# EAGLE design LF (EAGLE 7.6.0)
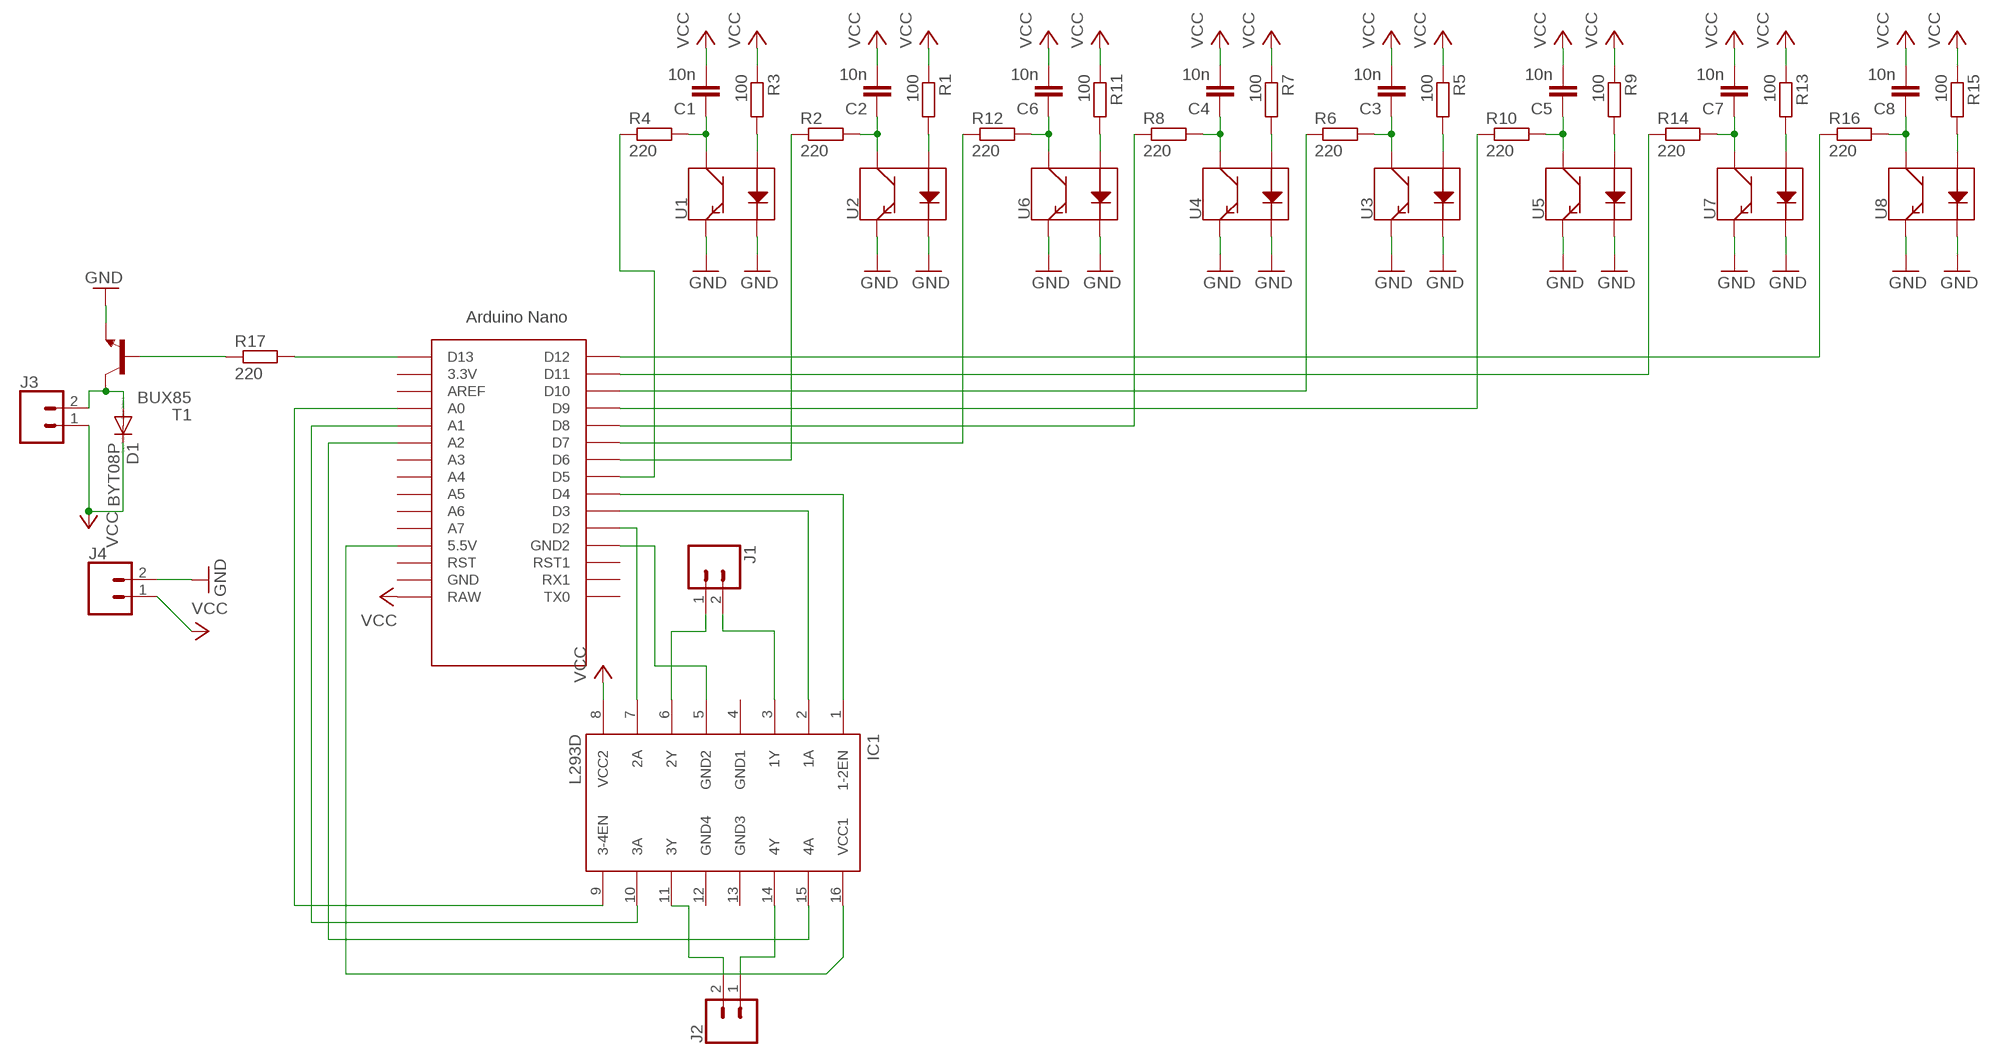
[diagram p0: schematic, sheet 1]

## Parts
C1  10n  C-EUC0402  [C0402]
C2  10n  C-EUC0402  [C0402]
C3  10n  C-EUC0402  [C0402]
C4  10n  C-EUC0402  [C0402]
C5  10n  C-EUC0402  [C0402]
C6  10n  C-EUC0402  [C0402]
C7  10n  C-EUC0402  [C0402]
C8  10n  C-EUC0402  [C0402]
D1  BYT08P  [TO220ACS]
IC1  L293D  [DIL16]
J1  CONN_02  [1X02]
J2  CONN_02  [1X02]
J3  CONN_02  [1X02]
J4  CONN_02  [1X02]
R1  100  R-EU_R0402  [R0402]
R2  220  R-EU_R0402  [R0402]
R3  100  R-EU_R0402  [R0402]
R4  220  R-EU_R0402  [R0402]
R5  100  R-EU_R0402  [R0402]
R6  220  R-EU_R0402  [R0402]
R7  100  R-EU_R0402  [R0402]
R8  220  R-EU_R0402  [R0402]
R9  100  R-EU_R0402  [R0402]
R10  220  R-EU_R0402  [R0402]
R11  100  R-EU_R0402  [R0402]
R12  220  R-EU_R0402  [R0402]
R13  100  R-EU_R0402  [R0402]
R14  220  R-EU_R0402  [R0402]
R15  100  R-EU_R0402  [R0402]
R16  220  R-EU_R0402  [R0402]
R17  220  R-EU_R1206  [R1206]
T1  BUX85  [TO220]
U1  QRE1113SMD-W  [QRE1113-W]
U2  QRE1113SMD-W  [QRE1113-W]
U3  QRE1113SMD-W  [QRE1113-W]
U4  QRE1113SMD-W  [QRE1113-W]
U5  QRE1113SMD-W  [QRE1113-W]
U6  QRE1113SMD-W  [QRE1113-W]
U7  QRE1113SMD-W  [QRE1113-W]
U8  QRE1113SMD-W  [QRE1113-W]
U$1  NANO  [NANO]

## Nets
GND: J4.2 T1.3(E) U1.2(K) U1.4(E) U2.2(K) U2.4(E) U3.2(K) U3.4(E) U4.2(K) U4.4(E) U5.2(K) U5.4(E) U6.2(K) U6.4(E) U7.2(K) U7.4(E) U8.2(K) U8.4(E)
N$1: R3.2 U1.1(A)
N$2: C1.1 R4.2 U1.3(C)
N$3: R16.1 U$1.D12
N$4: R1.2 U2.1(A)
N$5: C2.1 R2.2 U2.3(C)
N$6: R5.2 U3.1(A)
N$7: C3.1 R6.2 U3.3(C)
N$8: R7.2 U4.1(A)
N$9: C4.1 R8.2 U4.3(C)
N$10: R9.2 U5.1(A)
N$11: C5.1 R10.2 U5.3(C)
N$12: R11.2 U6.1(A)
N$13: C6.1 R12.2 U6.3(C)
N$14: R13.2 U7.1(A)
N$15: C7.1 R14.2 U7.3(C)
N$16: R15.2 U8.1(A)
N$17: C8.1 R16.2 U8.3(C)
N$18: R14.1 U$1.D11
N$19: R6.1 U$1.D10
N$20: R10.1 U$1.D9
N$21: R8.1 U$1.D8
N$22: R12.1 U$1.D7
N$23: R2.1 U$1.D6
N$24: R4.1 U$1.D5
N$25: IC1.1(1-2EN) U$1.D4
N$26: IC1.2(1A) U$1.D3
N$27: IC1.7(2A) U$1.D2
N$28: IC1.9(3-4EN) U$1.A0
N$29: IC1.10(3A) U$1.A1
N$30: IC1.15(4A) U$1.A2
N$31: IC1.6(2Y) J1.1
N$32: IC1.3(1Y) J1.2
N$33: IC1.5(GND2) U$1.GND1(GND2)
N$34: IC1.11(3Y) J2.2
N$35: IC1.14(4Y) J2.1
N$36: IC1.16(VCC1) U$1.5V(5.5V)
N$37: R17.2 U$1.D13
N$38: R17.1 T1.1(B)
N$39: D1.A J3.2 T1.2(C)
VCC: C1.2 C2.2 C3.2 C4.2 C5.2 C6.2 C7.2 C8.2 D1.C IC1.8(VCC2) J3.1 J4.1 R1.1 R3.1 R5.1 R7.1 R9.1 R11.1 R13.1 R15.1 U$1.RAW
Unconnected: U$1.3.3V U$1.A3 U$1.A4 U$1.A5 U$1.A6 U$1.A7 U$1.AREF U$1.GND U$1.ICSP1 U$1.ICSP2 U$1.ICSP3 U$1.ICSP4 U$1.ICSP5 U$1.ICSP6 U$1.RST U$1.RST1 U$1.RX1 U$1.TX0

## Power pins joined to a net without a drawn wire
GND1: IC1.4(GND1)
GND3: IC1.13(GND3)
GND4: IC1.12(GND4)

## Library data of the parts
C1-C8 = resistor:C-EU: CAPACITOR, European symbol
D1 = diode:BYT08P: DIODE ultra fast
IC1 = st-microelectronics:L293D: PUSH-PULL 4 CHANNEL DRIVER; MPN: L293D; OC_FARNELL: 9589619; OC_NEWARK: 56P8249
J1-J4 = SparkFun-Connectors:CONN_02: Multi connection point. Often used as Generic Header-pin footprint for 0.1 inch spaced/style header connections On any of the 0.1 inch spaced packages, you can populate with these: Break Away Headers - Straight <https://www.sparkfun.com/products/116> (PRT-00116) Break Away Male Headers - Right Angle <https://www.sparkfun.com/products/553> (PRT-00553) Female Headers <https://www.sparkfun.com/products/115> (PRT-00115) Break Away Headers - Machine Pin <https://www.sparkfun.com/products/117> (PRT-00117) Break Away Female Headers - Swiss Machine Pin <https://www.sparkfun.com/products/743> (PRT-00743) For SCREWTERMINALS and SPRING TERMINALS visit here: Screw Terimnals on SparkFun.com <https://www.sparkfun.com/search/results?term=Screw+Terminals> (5mm/3.5mm/2.54mm spacing) This device is also useful as a general connection point to wire up your design to another part of your project. Our various solder wires solder well into these plated through hole pads. Hook-Up Wire - Assortment (Stranded, 22 AWG) <https://www.sparkfun.com/products/11375> (PRT-11375) Hook-Up Wire - Assortment (Solid Core, 22 AWG) <https://www.sparkfun.com/products/11367> (PRT-11367) View the entire wire category on our website here <https://www.sparkfun.com/categories/141> Special notes: Molex polarized connector foot print use with: PRT-08233 with associated crimp pins and housings. 2.54_SCREWTERM for use with PRT-10571. 3.5mm Screw Terminal footprints for PRT-08084 5mm Screw Terminal footprints for use with PRT-08432
R1-R17 = resistor:R-EU_: RESISTOR, European symbol
T1 = transistor:BUX85: NPN TRANSISTOR
U1-U8 = SparkFun-Sensors:QRE1113: QRE1113 Reflective Object Sensor The QRE1113 is a small IR reflectance sensor. This sensor is often used in line following robots because, if it can sense if a surface is white or black. There are four pins on the QRE1113 - two control the IR emitting LED while the other two are the collector and emitter of a phototransistor. The IR diode has a max forward current of 50mA and operates at 940nm. Datasheet <http://www.sparkfun.com/datasheets/Components/SMD/QRE1113.GR.pdf> SparkFun Products IR Reflectance Sensor - QRE1113 <https://www.sparkfun.com/products/9542> (COM-09542) SparkFun Line Sensor Breakout - QRE1113 (Analog) <https://www.sparkfun.com/products/9453> (ROB-09453) SparkFun Line Sensor Breakout - QRE1113 (Digital) <https://www.sparkfun.com/products/9454> (ROB-09454) SparkFun RedBot Sensor - Line Follower <https://www.sparkfun.com/products/11769> (SEN-11769) SparkFun RedBot Sensor - Wheel Encoder <https://www.sparkfun.com/products/12617> (SEN-12617) SparkFun Line Follower Array <https://www.sparkfun.com/products/13582> (SEN-13582); PROD_ID: IC-09357; SF_ID: COM-09542
U$1 = Arduino-clone:NANO: Arduino Nano

## Board
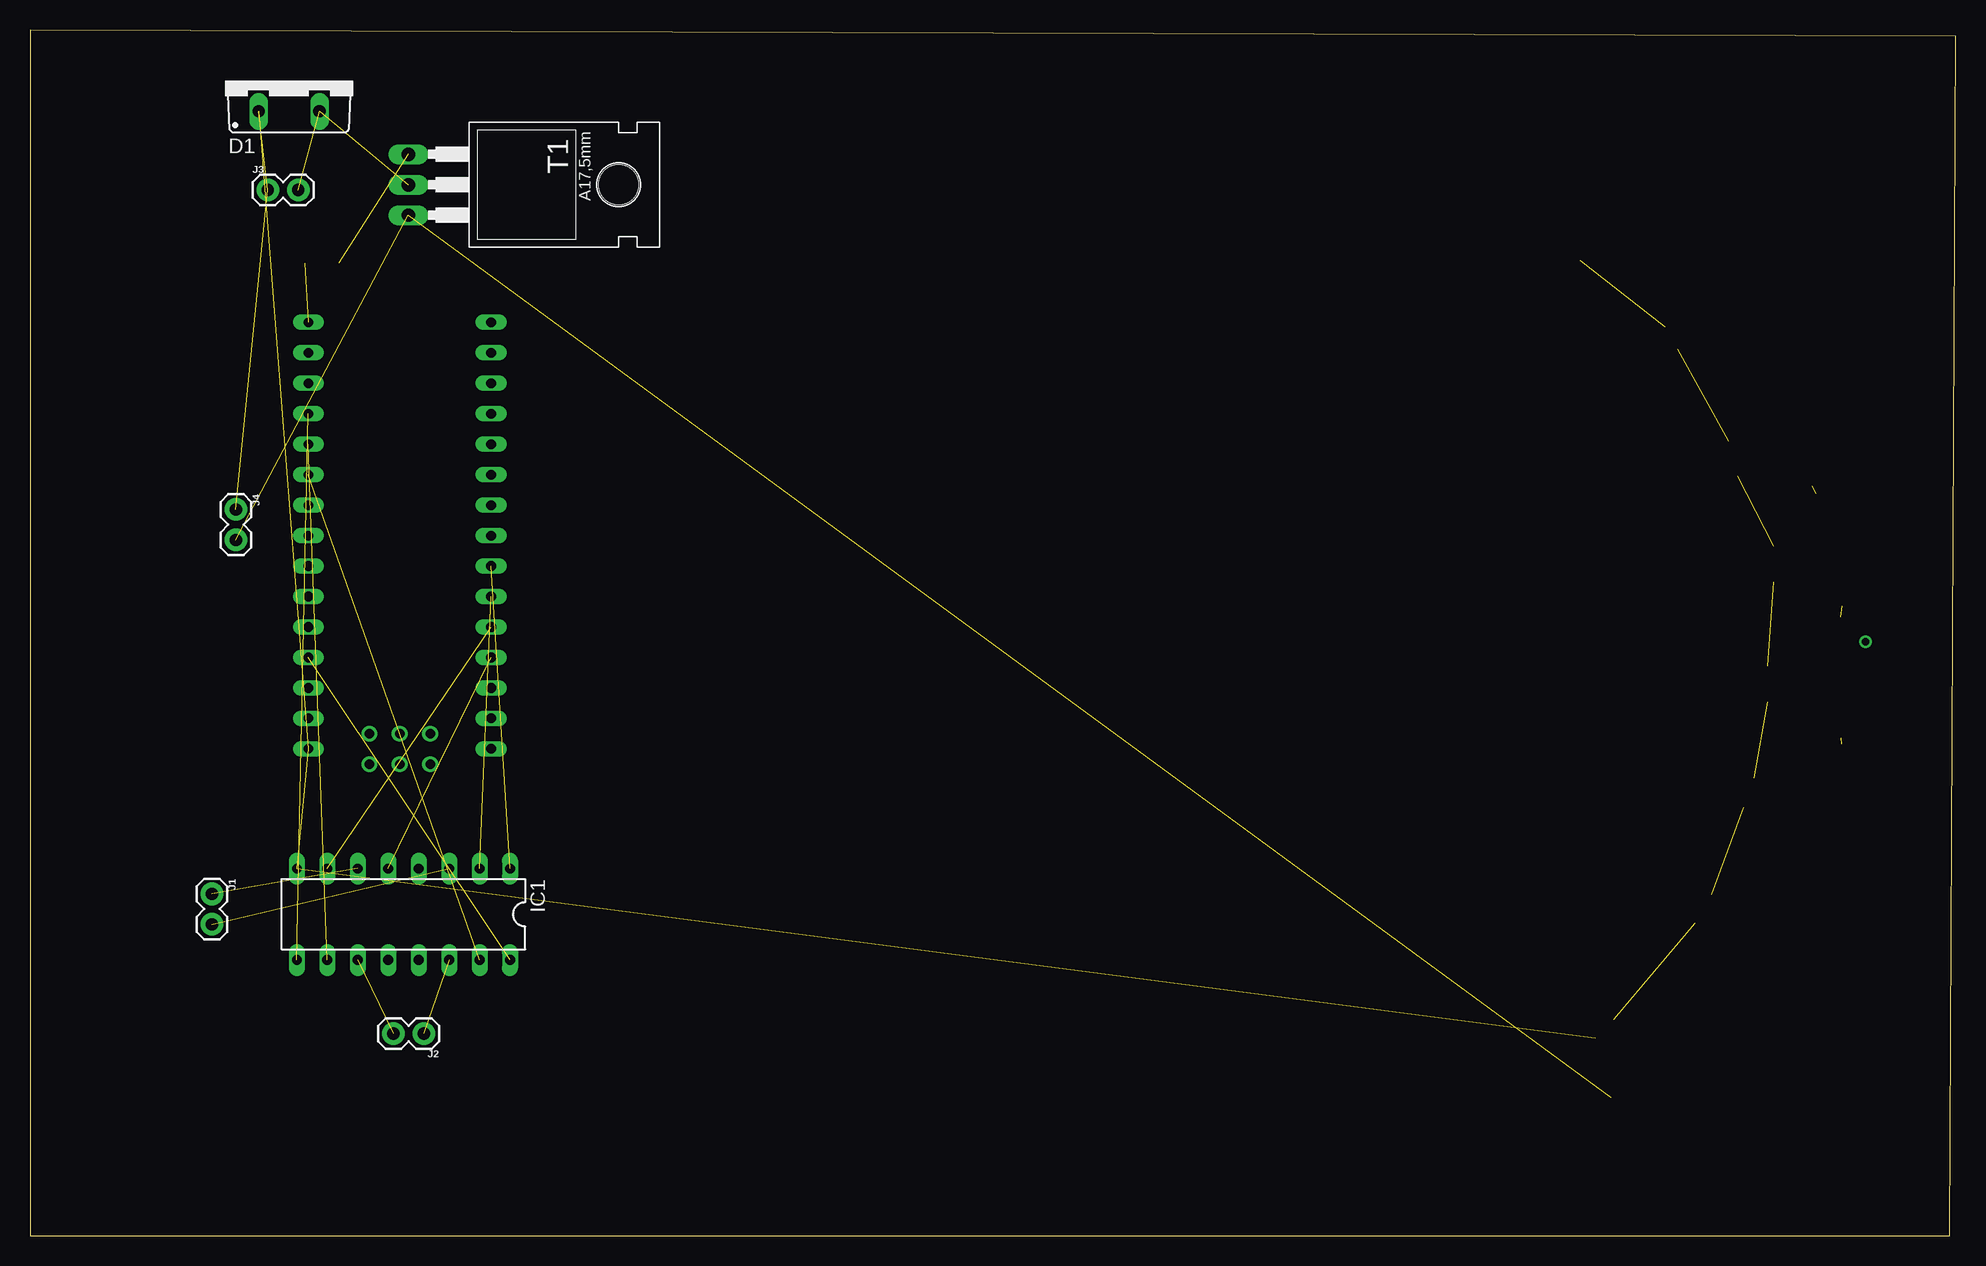
[diagram p1: board, top side]
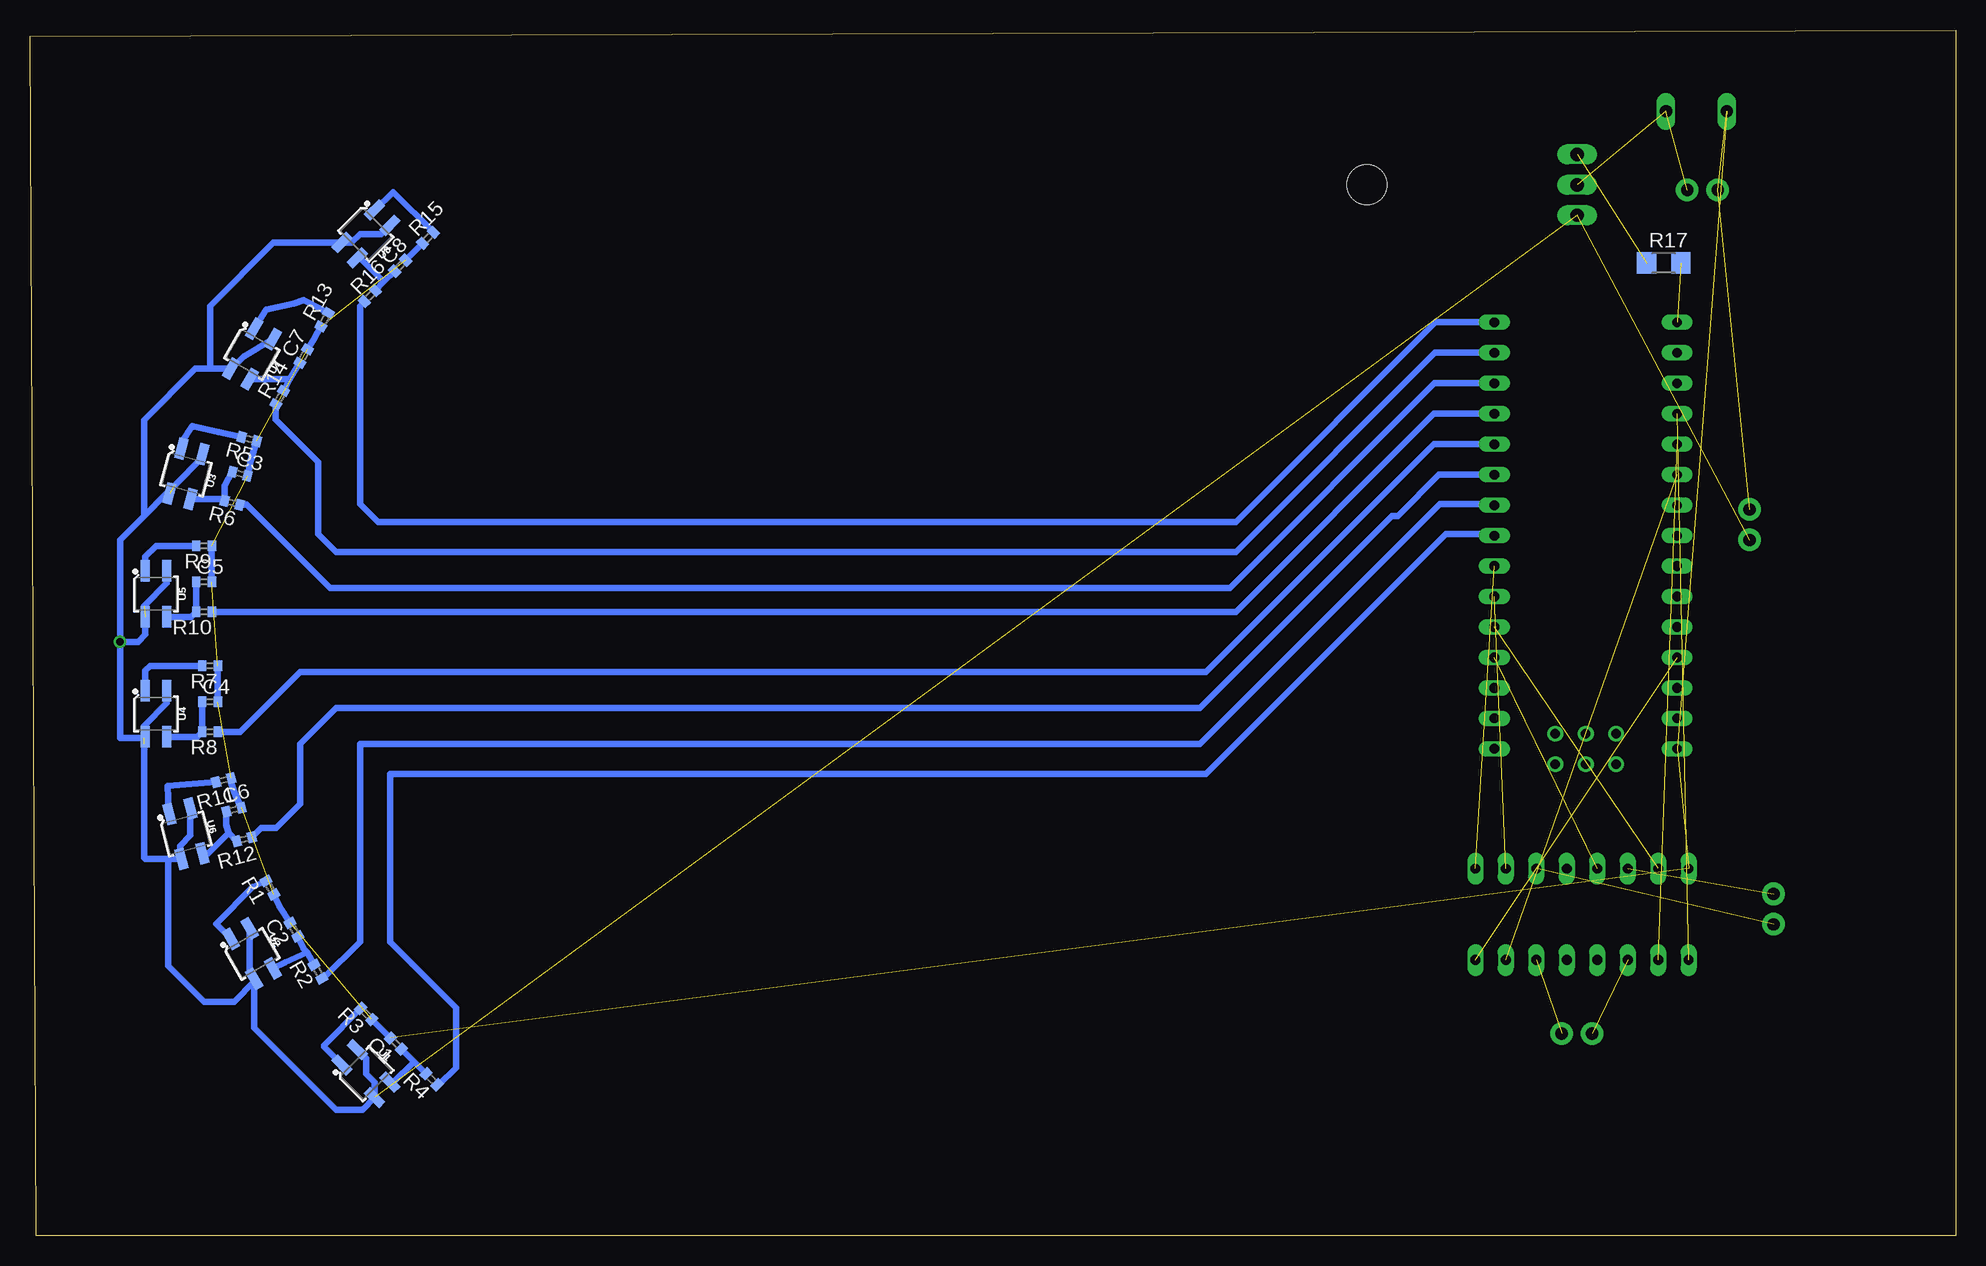
[diagram p2: board, bottom side, seen from below]

Size 160.5 x 100.5 mm. Coordinates in mm from the lower left corner, seen from the top.
Outline: 0,0 160,0 160.5,100 0,100.5 0,0
Copper layers (1*16): Top 0.035mm / dielectric 1.5mm / Bottom 0.035mm
Design rules "default": minimum track width 10mil, minimum drill 24mil, track to track 8mil, track to pad 8mil, pad to pad 8mil, via to via 8mil, smd to smd 8mil, copper to edge 40mil, drill to drill 8mil, minimum pad ring 10mil, minimum via ring 8mil, stop-mask expansion 4mil, vias tented up to drill 0mil, thermal gap 10mil

### Footprints (pad centres in the part's own frame; a part is rotated, then mirrored left to right if it is on the bottom)
C0402 = smd 0.7 x 0.9: 1 -0.65,0; 2 0.65,0
TO220ACS = drill 1.016 long: A 2.54,-2.54; C -2.54,-2.54
DIL16 = drill 0.813 long: 1 -8.89,-3.81; 2 -6.35,-3.81; 3 -3.81,-3.81; 4 -1.27,-3.81; 5 1.27,-3.81; 6 3.81,-3.81; 7 6.35,-3.81; 8 8.89,-3.81; 9 8.89,3.81; 10 6.35,3.81; 11 3.81,3.81; 12 1.27,3.81; 13 -1.27,3.81; 14 -3.81,3.81; 15 -6.35,3.81; 16 -8.89,3.81
1X02 = drill 1.016 pad 1.88: 1 0,0; 2 2.54,0
R0402 = smd 0.7 x 0.9: 1 -0.65,0; 2 0.65,0
R1206 = smd 1.6 x 1.803: 1 -1.422,0; 2 1.422,0
TO220 = drill 1.118 long: 1 -2.54,-6.35; 2 0,-6.35; 3 2.54,-6.35 | hole 3.302: 0,11.176
QRE1113-W = smd 1.778 x 0.762: 1 -1.927,-0.9; 2 1.927,-0.9; 3 1.927,0.9; 4 -1.927,0.9
NANO = drill 0.8 long: 3.3V -10.16,24.13; 5V -10.16,-1.27; A0 -10.16,19.05; A1 -10.16,16.51; A2 -10.16,13.97; A3 -10.16,11.43; A4 -10.16,8.89; A5 -10.16,6.35; A6 -10.16,3.81; A7 -10.16,1.27; AREF -10.16,21.59; D2 5.08,1.27; D3 5.08,3.81; D4 5.08,6.35; D5 5.08,8.89; D6 5.08,11.43; D7 5.08,13.97; D8 5.08,16.51; D9 5.08,19.05; D10 5.08,21.59; D11 5.08,24.13; D12 5.08,26.67; D13 -10.16,26.67; GND -10.16,-6.35; GND1 5.08,-1.27; RAW -10.16,-8.89; RST -10.16,-3.81; RST1 5.08,-3.81; RX1 5.08,-6.35; TX0 5.08,-8.89 | drill 0.8: ICSP1 -5.08,-10.16; ICSP2 -5.08,-7.62; ICSP3 -2.54,-10.16; ICSP4 -2.54,-7.62; ICSP5 0,-10.16; ICSP6 0,-7.62

### Placement (x,y rotation side)
C1  130,16 135 bottom
C2  138.5,25.5 120 bottom
C3  143,63.5 345 bottom
C4  145.5,44.5 0 bottom
C5  146,54.5 0 bottom
C6  143.5,35.5 15 bottom
C7  137.68,73.32 60 bottom
C8  129.65,80.85 45 bottom
D1  21.59,96.26 0 top
IC1  31.13,26.78 180 top
J1  15.16,28.48 270 top
J2  32.83,16.84 180 top
J3  19.82,87.16 0 top
J4  17.16,60.53 270 top
R1  140.5,29 120 bottom
R2  136.5,22 120 bottom
R3  132.47,18.47 135 bottom
R4  127.03,13.03 135 bottom
R5  142.22,66.4 165 bottom
R6  143.65,61.09 165 bottom
R7  145.5,47.5 180 bottom
R8  145.5,42 180 bottom
R9  146,57.5 180 bottom
R10  146,52 180 bottom
R11  144.36,37.96 195 bottom
R12  142.64,33.04 195 bottom
R13  135.93,76.35 60 bottom
R14  139.68,69.85 60 bottom
R15  127.32,83.18 45 bottom
R16  132.18,78.32 45 bottom
R17  24.32,81.08 0 bottom
T1  37.89,87.6 270 top
U1  132.5,13.5 315 bottom
U2  142,23.5 300 bottom
U3  147.5,63.5 255 bottom
U4  150,43.5 270 bottom
U5  150,53.5 270 bottom
U6  147.5,33.5 285 bottom
U7  142,73.5 240 bottom
U8  132.5,83.5 225 bottom
U$1  33.36,49.46 0 top

### Tracks (layer width: path | path; a pad name or v marks a point on that pad's centre or on a via)
GND  (5 unrouted)
  Bottom 0.55: U1.4 132.5,14.77 132.5,13.5 131.77,12.77 U1.2 132.78,10.5 135,10.5 141.82,17.32 141.82,21.18 | U2.4 142.18,21.75 U2.2 141.82,21.18 | U6.4 147.13,33.37 148,32.5 148,31.54 U6.2 149,31.41 | U4.4 149.1,44.4 151,42.5 151,41.67 U4.2 150.97,41.5 153,41.5 153,49.5 | U5.4 149.1,54.4 151,52.5 | U3.4 146.13,64.87 148.5,62.5 | U7.4 142.69,73.28 U7.2 145.5,72.28 | U5.2 150.9,50.1 151.5,49.5 153,49.5 | U3.2 149.13,61.87 151,60 | 151,60 153,58 153,49.5 | 145.5,72.28 146.72,72.28 151,68 151,60 | 145.5,72.28 145.5,77.5 140.23,82.77 U8.2 133.73,82.77 133,83.5 131.23,83.5 U8.4 | 149,31.41 150.91,31.41 151,31.5 151,41 | 141.82,21.18 143.5,19.5 146,19.5 149,22.5 149,31.41
N$1
  Bottom 0.55: U1.1 136,15.73 136,15.87 R3.2
N$2
  Bottom 0.55: U1.3 130.23,12.77 128.5,14.5 | C1.1 128.5,14.5 | 128.5,14.5 R4.2
N$3
  Bottom 0.55: R16.1 | R16.1 133,77.5 133,61 131.5,59.5 60,59.5 43.37,76.13 U$1.D12
N$4
  Bottom 0.55: R1.2 141.94,29.06 145,26 144,24.98 U2.1
N$5
  Bottom 0.55: C2.1 137.68,23.91 137.38,23.62 | 137.38,23.62 R2.2 | U2.3 139.22,22.78 137.38,23.62
N$6
  Bottom 0.55: U3.1 147.87,66.13 147,67.5 144.78,67 R5.2
N$7
  Bottom 0.55: C3.1 144.28,62.52 R6.2 144.43,61.41 U3.3
N$8
  Bottom 0.55: U4.1 150.9,47.1 150.5,47.5 R7.2
N$9
  Bottom 0.55: C4.1 R8.2 146.58,41.57 U4.3
N$10
  Bottom 0.55: U5.1 150.9,56.6 150,57.5 R9.2
N$11
  Bottom 0.55: C5.1 R10.2 147.08,51.57 U5.3
N$12
  Bottom 0.55: R11.2 149.01,37.49 149,36.5 149,35.26 U6.1
N$13
  Bottom 0.55: C6.1 144.13,34.23 143.95,33.55 | 143.95,33.55 R12.2 | U6.3 145.63,31.87 143.95,33.55
N$14
  Bottom 0.55: U7.1 140.82,77.18 138.51,77.68 137.7,78 R13.2
N$15
  Bottom 0.55: R14.2 138.86,71.4 | 138.86,71.4 C7.1 | U7.3 139.38,71.38 138.86,71.4
N$16
  Bottom 0.55: U8.1 130.22,87 R15.2
N$17
  Bottom 0.55: C8.1 131,79.5 | 131,79.5 R16.2 | U8.3 133,81.5 131,79.5
N$18
  Bottom 0.55: R14.1 140.01,68.01 136.5,64.5 136.5,58.5 135,57 60,57 43.41,73.59 U$1.D11
N$19
  Bottom 0.55: R6.1 142.42,60.92 135.5,54 60.5,54 43.45,71.05 U$1.D10
N$20
  Bottom 0.55: U$1.D9 43.49,68.51 60,52 R10.1
N$21
  Bottom 0.55: R8.1 143,42 138,47 62.5,47 43.5,66 43.47,65.97 U$1.D8
N$22
  Bottom 0.55: U$1.D7 43.07,63.43 46.5,60 47,60 63,44 135,44 138,41 138,36 140,34 141.21,34 R12.1
N$23
  Bottom 0.55: R2.1 136.06,21.44 133,24.5 133,41 63,41 43,61 38.55,61 U$1.D6
N$24
  Bottom 0.55: R4.1 126.43,12.57 125,14 125,19 130.5,24.5 130.5,38.5 62.5,38.5 42.5,58.5 38.59,58.5 U$1.D5
N$25  (1 unrouted)
N$26  (1 unrouted)
N$27  (1 unrouted)
N$28  (1 unrouted)
N$29  (1 unrouted)
N$30  (1 unrouted)
N$31  (1 unrouted)
N$32  (1 unrouted)
N$33  (1 unrouted)
N$34  (1 unrouted)
N$35  (1 unrouted)
N$36  (1 unrouted)
N$37  (1 unrouted)
N$38  (1 unrouted)
N$39  (2 unrouted)
N$40  (via drill 0.6)
  other vias: 153,49.5
VCC  (12 unrouted)
  Bottom 0.55: R3.1 C1.2 | R1.1 139.68,27.41 C2.2 | R7.1 C4.2 | R11.1 143.74,37.74 143.5,37 143,35.8 C6.2 | R9.1 C5.2 | R5.1 142.1,64.61 C3.2 | C7.2 136.86,74.69 R13.1 | R15.1 C8.2